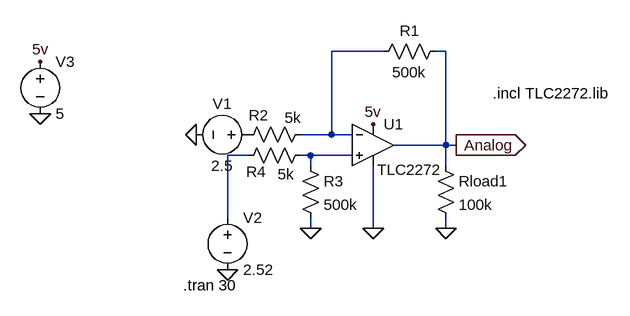
[diagram p0: schematic Draft1.asc]
Draft1.asc, the LTspice schematic file:
Version 4
SHEET 1 880 680
WIRE 224 48 144 48
WIRE 320 48 304 48
WIRE 144 176 144 48
WIRE 144 176 96 176
WIRE 176 176 144 176
WIRE 320 192 320 48
WIRE 320 192 240 192
WIRE 336 192 320 192
WIRE 16 208 -16 208
WIRE 112 208 96 208
WIRE 176 208 112 208
WIRE 112 224 112 208
WIRE 320 224 320 192
WIRE -16 304 -16 208
WIRE 112 320 112 304
WIRE 208 320 208 224
WIRE 320 320 320 304
FLAG 336 192 Analog
IOPIN 336 192 Out
FLAG 320 320 0
FLAG 208 320 0
FLAG 112 320 0
FLAG -64 176 0
FLAG -16 384 0
FLAG -304 144 0
FLAG -304 64 5v
FLAG 208 160 5v
SYMBOL res 304 208 R0
SYMATTR InstName Rload1
SYMATTR Value 100k
SYMBOL res 320 32 R90
WINDOW 0 0 56 VBottom 2
WINDOW 3 32 56 VTop 2
SYMATTR InstName R1
SYMATTR Value 500k
SYMBOL res 112 160 R90
WINDOW 0 2 80 VBottom 2
WINDOW 3 -26 27 VTop 2
SYMATTR InstName R2
SYMATTR Value 5k
SYMBOL Opamps\\opamp2 208 128 R0
WINDOW 3 6 102 Left 2
SYMATTR Value TLC2272
SYMATTR InstName U1
SYMBOL res 96 208 R0
SYMATTR InstName R3
SYMATTR Value 500k
SYMBOL res 112 192 R90
WINDOW 0 57 84 VBottom 2
WINDOW 3 29 38 VTop 2
SYMATTR InstName R4
SYMATTR Value 5k
SYMBOL voltage 32 176 R90
WINDOW 0 -32 56 VBottom 2
WINDOW 3 32 56 VTop 2
WINDOW 123 0 0 Left 0
WINDOW 39 0 0 Left 0
SYMATTR InstName V1
SYMATTR Value 2.5
SYMBOL voltage -16 288 R0
WINDOW 123 0 0 Left 0
WINDOW 39 0 0 Left 0
SYMATTR InstName V2
SYMATTR Value 2.52
SYMBOL voltage -304 48 R0
WINDOW 123 0 0 Left 0
WINDOW 39 0 0 Left 0
SYMATTR InstName V3
SYMATTR Value 5
TEXT -84 408 Left 2 !.tran 30
TEXT 392 112 Left 2 !.incl TLC2272.lib

The netlist it stands for:
* Draft1.asc
Rload1 Analog 0 100k
R1 Analog N001 500k
R2 N001 P001 5k
XU1 N003 N001 5v 0 Analog TLC2272  ; pins In+ In- V+ V- OUT
R3 N003 0 500k
R4 N003 N002 5k
V1 P001 0 2.5
V2 N002 0 2.52
V3 5v 0 5
.tran 30
.incl TLC2272.lib
.backanno
.end